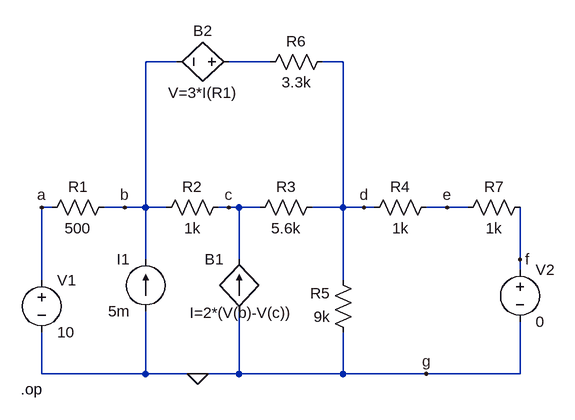
[diagram p0: schematic Circuit1.asc]
Circuit1.asc, the LTspice schematic file:
Version 4
SHEET 1 880 680
WIRE 208 -192 160 -192
WIRE 352 -192 288 -192
WIRE 464 -192 432 -192
WIRE 16 32 0 32
WIRE 128 32 96 32
WIRE 160 32 160 -192
WIRE 160 32 128 32
WIRE 192 32 160 32
WIRE 288 32 272 32
WIRE 304 32 288 32
WIRE 336 32 304 32
WIRE 464 32 464 -192
WIRE 464 32 416 32
WIRE 496 32 464 32
WIRE 512 32 496 32
WIRE 624 32 592 32
WIRE 656 32 624 32
WIRE 160 112 160 32
WIRE 304 112 304 32
WIRE 736 112 736 32
WIRE 736 128 736 112
WIRE 0 144 0 32
WIRE 464 144 464 32
WIRE 0 288 0 224
WIRE 160 288 160 192
WIRE 160 288 0 288
WIRE 240 288 160 288
WIRE 304 288 304 192
WIRE 304 288 240 288
WIRE 464 288 464 224
WIRE 464 288 304 288
WIRE 592 288 464 288
WIRE 736 288 736 208
WIRE 736 288 592 288
FLAG 240 288 0
FLAG 288 32 c
FLAG 0 32 a
FLAG 128 32 b
FLAG 496 32 d
FLAG 624 32 e
FLAG 736 112 f
FLAG 592 288 g
SYMBOL res 112 16 R90
WINDOW 0 0 56 VBottom 2
WINDOW 3 32 56 VTop 2
SYMATTR InstName R1
SYMATTR Value 500
SYMBOL res 288 16 R90
WINDOW 0 0 56 VBottom 2
WINDOW 3 32 56 VTop 2
SYMATTR InstName R2
SYMATTR Value 1k
SYMBOL res 432 16 R90
WINDOW 0 0 56 VBottom 2
WINDOW 3 32 56 VTop 2
SYMATTR InstName R3
SYMATTR Value 5.6k
SYMBOL res 608 16 R90
WINDOW 0 0 56 VBottom 2
WINDOW 3 32 56 VTop 2
SYMATTR InstName R4
SYMATTR Value 1k
SYMBOL res 480 240 R180
WINDOW 0 36 76 Left 2
WINDOW 3 36 40 Left 2
SYMATTR InstName R5
SYMATTR Value 9k
SYMBOL res 336 -176 R270
WINDOW 0 32 56 VTop 2
WINDOW 3 0 56 VBottom 2
SYMATTR InstName R6
SYMATTR Value 3.3k
SYMBOL voltage 0 128 R0
SYMATTR InstName V1
SYMATTR Value 10
SYMBOL current 160 192 R180
WINDOW 0 24 80 Left 2
WINDOW 3 24 0 Left 2
SYMATTR InstName I1
SYMATTR Value 5m
SYMBOL bi 304 192 R180
WINDOW 0 24 80 Left 2
WINDOW 3 -82 -2 Left 2
SYMATTR InstName B1
SYMATTR Value I=2*(V(b)-V(c))
SYMBOL bv 304 -192 R90
WINDOW 0 -32 56 VBottom 2
WINDOW 3 32 56 VTop 2
SYMATTR InstName B2
SYMATTR Value V=3*I(R1)
SYMBOL res 752 16 R90
WINDOW 0 0 56 VBottom 2
WINDOW 3 32 56 VTop 2
SYMATTR InstName R7
SYMATTR Value 1k
SYMBOL voltage 736 112 R0
WINDOW 123 0 0 Left 0
WINDOW 39 0 0 Left 0
SYMATTR InstName V2
SYMATTR Value 0
TEXT -32 312 Left 2 !.op

The netlist it stands for:
* Circuit1.asc
R1 b a 500
R2 c b 1k
R3 d c 5.6k
R4 e d 1k
R5 0 d 9k
R6 N001 d 3.3k
V1 a 0 10
I1 0 b 5m
B1 0 c I=2*(V(b)-V(c))
B2 N001 b V=3*I(R1)
R7 f e 1k
V2 f 0 0
.op
.backanno
.end